# EAGLE schematic schematic (EAGLE 9.6.2)
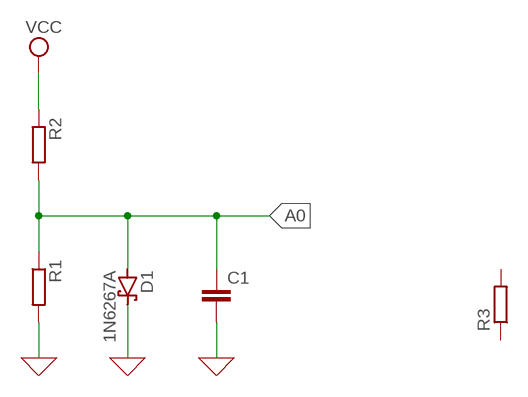
[diagram p0: schematic, sheet 1]

## Parts
C1  C-EU025-025X050  [C025-025X050]
D1  1N6267A  [C4111-15]
R1  R-EU_0204/7  [0204/7]
R2  R-EU_0204/7  [0204/7]
R3  R-EU_0204/7  [0204/7]

## Nets
0: C1.2 D1.C R1.2 ; supply symbol labelled GND
A0: C1.1 D1.A R1.1 R2.2
VCC: R2.1
Unconnected: R3.1 R3.2

## Library data of the parts
C1 = rcl:C-EU: CAPACITOR, European symbol; SPICEPREFIX: C
D1 = diode:1N6267A: DIODE transient voltage suppressor
R1-R3 = rcl:R-EU_: RESISTOR, European symbol; SPICEPREFIX: R